# Altium project LabGener.PrjPcb
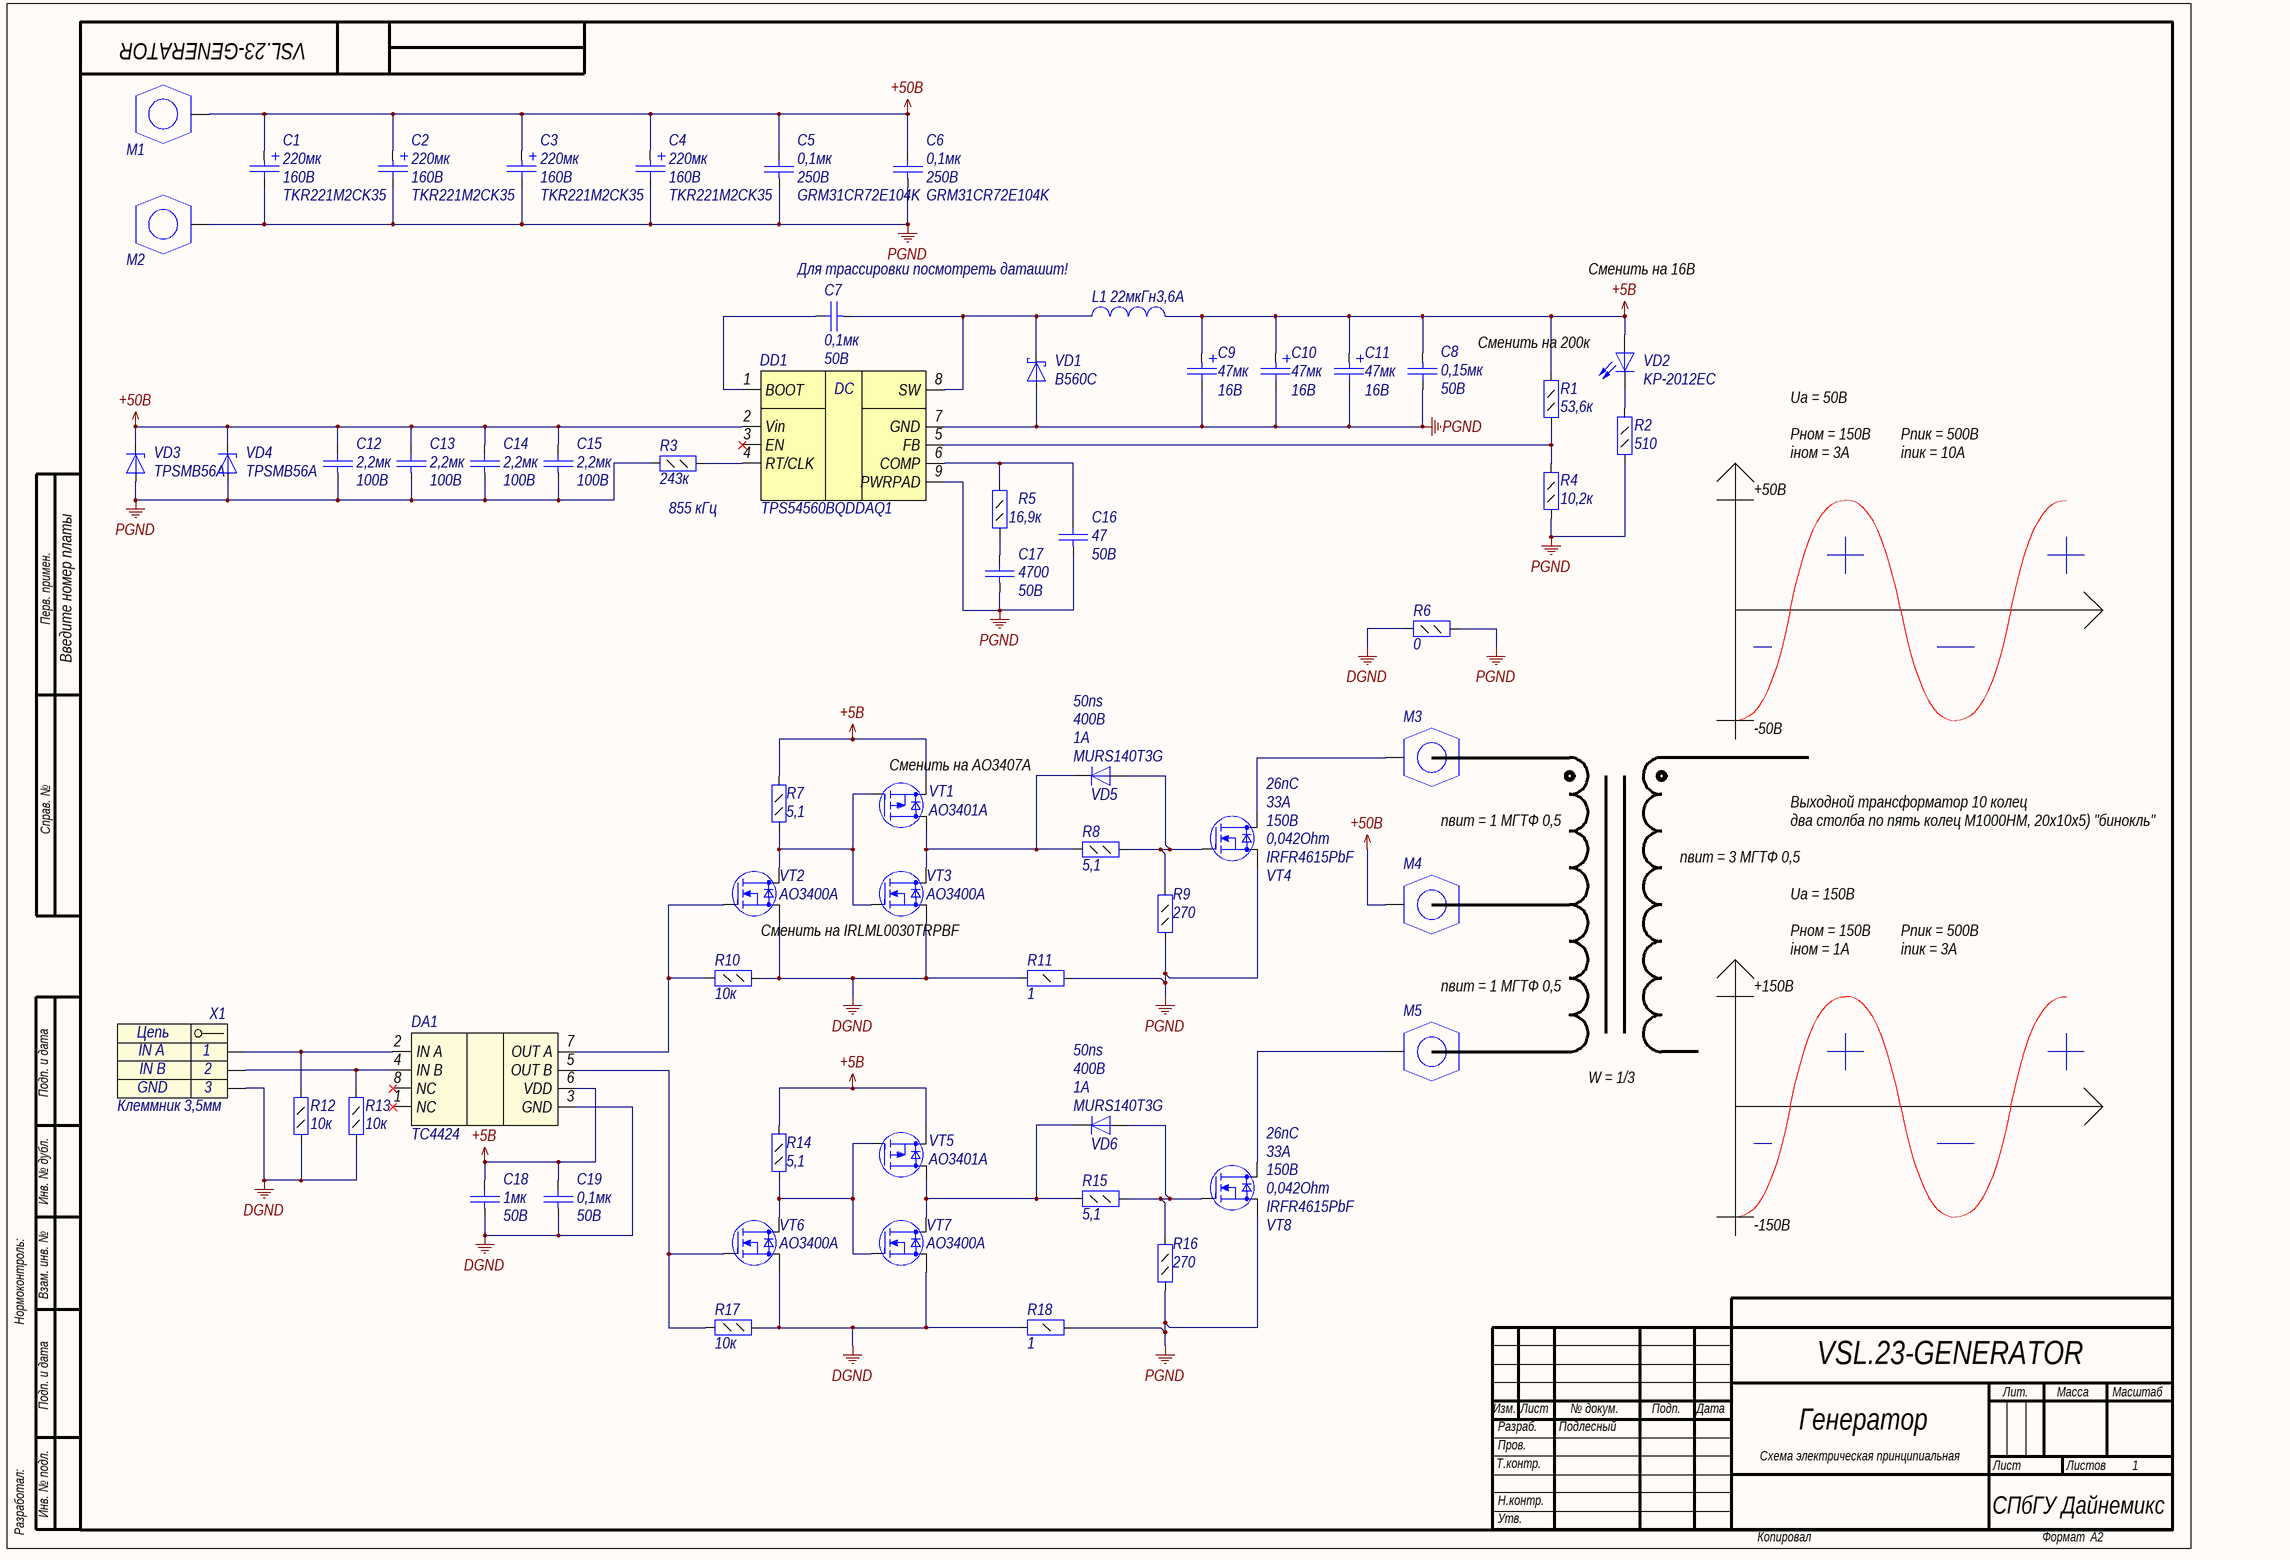
[diagram p0: LabGener.SchDoc]
1 sheet, 60 parts. Net scope: global (net labels, ports and power ports of the same name join across sheets).
Board file: LabGener.PcbDoc

## Sheet LabGener.SchDoc: Название платы
size 594 x 420 mm; ApprovedBy: Рогов; CheckedBy: Фамилия проверяющего; DrawnBy: Подлесный; Organization: СПбГУ Дайнемикс; DocumentNumber: VSL.23-GENERATOR; SheetNumber: пусто если листов 1, иначе 1; SheetTotal: количество листов; Format: A2; DocumentType: Схема электрическая принципиальная; Title1str: (вторая строка при необходимости); ImagePath: Введите номер платы

### Parts
C1  value 220мк  Voltage: 160B  Part Number: TKR221M2CK35  [K50-35(16X35)_V]  (hidden comment: Capacitor_pol)
C2  value 220мк  Voltage: 160B  Part Number: TKR221M2CK35  [K50-35(16X35)_V]  (hidden comment: Capacitor_pol)
C3  value 220мк  Voltage: 160B  Part Number: TKR221M2CK35  [K50-35(16X35)_V]  (hidden comment: Capacitor_pol)
C4  value 220мк  Voltage: 160B  Part Number: TKR221M2CK35  [K50-35(16X35)_V]  (hidden comment: Capacitor_pol)
C5  Voltage: 250В  Part Number: GRM31CR72E104K  [C1206]  (hidden comment: 0,1мк)
C6  Voltage: 250В  Part Number: GRM31CR72E104K  [C1206]  (hidden comment: 0,1мк)
C7  Voltage: 50В  [C0402]  (hidden comment: 0,1мк)
C8  Voltage: 50В  [C1812]  (hidden comment: 0,15мк)
C9  value 47мк  Voltage: 16В  [TANTAL CASE C]  (hidden comment: Capacitor_pol)
C10  value 47мк  Voltage: 16В  [TANTAL CASE C]  (hidden comment: Capacitor_pol)
C11  value 47мк  Voltage: 16В  [TANTAL CASE C]  (hidden comment: Capacitor_pol)
C12  Voltage: 100В  [C1812]  (hidden comment: 2,2мк)
C13  Voltage: 100В  [C1812]  (hidden comment: 2,2мк)
C14  Voltage: 100В  [C1812]  (hidden comment: 2,2мк)
C15  Voltage: 100В  [C1812]  (hidden comment: 2,2мк)
C16  Voltage: 50В  [C0805]  (hidden comment: 47)
C17  Voltage: 50В  [C0805]  (hidden comment: 4700)
C18  Voltage: 50B  [C0805]  (hidden comment: 1мк)
C19  Voltage: 50В  [C0805]  (hidden comment: 0,1мк)
DA1  TC4424  [DIP8]
DD1  Part Number: TPS54560BQDDAQ1  [SO Powerpad8]  (hidden comment: TPS54560)
L1  value 22мкГн  Rated Current: 3,6A  [IND_12.5x12.5]  (hidden comment: Inductor)
M1  SCREW  [SCREW2.5]  (value not drawn)
M2  SCREW  [SCREW2.5]  (value not drawn)
M3  SCREW  [SCREW2.5]  (value not drawn)
M4  SCREW  [SCREW2.5]  (value not drawn)
M5  SCREW  [SCREW2.5]  (value not drawn)
R1  value 53,6к  [R0805]  (hidden comment: Resistor_0,125Вт)
R2  value 510  [R0805]  (hidden comment: Resistor_0,125Вт)
R3  value 243к  [R0805]  (hidden comment: Resistor_0,125Вт)
R4  value 10,2к  [R0805]  (hidden comment: Resistor_0,125Вт)
R5  value 16,9к  [R0805]  (hidden comment: Resistor_0,125Вт)
R6  value 0  [R0805]  (hidden comment: Resistor_0,125Вт)
R7  value 5,1  [R0805]  (hidden comment: Resistor_0,125Вт)
R8  value 5,1  [R0805]  (hidden comment: Resistor_0,125Вт)
R9  value 270  [R0805]  (hidden comment: Resistor_0,125Вт)
R10  value 10к  [R0805]  (hidden comment: Resistor_0,125Вт)
R11  value 1  [R1206]  (hidden comment: Resistor_0,25Вт)
R12  value 10к  [R0805]  (hidden comment: Resistor_0,125Вт)
R13  value 10к  [R0805]  (hidden comment: Resistor_0,125Вт)
R14  value 5,1  [R0805]  (hidden comment: Resistor_0,125Вт)
R15  value 5,1  [R0805]  (hidden comment: Resistor_0,125Вт)
R16  value 270  [R0805]  (hidden comment: Resistor_0,125Вт)
R17  value 10к  [R0805]  (hidden comment: Resistor_0,125Вт)
R18  value 1  [R1206]  (hidden comment: Resistor_0,25Вт)
VD1  Part Number: B560C  [SMC]  (hidden comment: DiodeSchottky)
VD2  Part Number: KP-2012EC  [L_0805]  (hidden comment: LED)
VD3  Part Number: TPSMB56A  [SMB]  (hidden comment: DiodeZener)
VD4  Part Number: TPSMB56A  [SMB]  (hidden comment: DiodeZener)
VD5  Forward Current: 1A  Breakdown Voltage: 400B  Reverse Recovery time: 50ns  Part Number: MURS140T3G  [SMB]  (hidden comment: Diode)
VD6  Forward Current: 1A  Breakdown Voltage: 400B  Reverse Recovery time: 50ns  Part Number: MURS140T3G  [SMB]  (hidden comment: Diode)
VT1  Part Number: AO3401A  [SOT23-3]  (hidden comment: P-MOSFET)
VT2  Part Number: AO3400A  [SOT23-3]  (hidden comment: N-MOSFET)
VT3  Part Number: AO3400A  [SOT23-3]  (hidden comment: N-MOSFET)
VT4  V drain-source max: 150B  Rds: 0,042Ohm  Continuous drain current: 33A  Total gate charge: 26nC  Part Number: IRFR4615PbF  [DPAK]  (hidden comment: N-MOSFET)
VT5  Part Number: AO3401A  [SOT23-3]  (hidden comment: P-MOSFET)
VT6  Part Number: AO3400A  [SOT23-3]  (hidden comment: N-MOSFET)
VT7  Part Number: AO3400A  [SOT23-3]  (hidden comment: N-MOSFET)
VT8  V drain-source max: 150B  Rds: 0,042Ohm  Continuous drain current: 33A  Total gate charge: 26nC  Part Number: IRFR4615PbF  [DPAK]  (hidden comment: N-MOSFET)
X1  Клеммник 3,5мм  [TERMINAL-3WAY-3.5MM]

### Nets
+5B: C8.1 C9.1 C10.1 C11.1 C18.2 C19.2 DA1.6(VDD) L1.2 R1.2 R7.2 R14.2 VD2.2(A) VT1.3(S) VT5.3(S)
+50B: C1.1 C2.1 C3.1 C4.1 C5.2 C6.2 C12.2 C13.2 C14.2 C15.2 DD1.2(Vin) M1.1 M4.1 VD3.1(K) VD4.1(K)
DGND: C18.1 C19.1 DA1.3(GND) R6.1 R10.1 R11.1 R12.1 R13.1 R17.1 R18.1 VT2.3(S) VT3.3(S) VT6.3(S) VT7.3(S) X1.3
PGND: C1.2 C2.2 C3.2 C4.2 C5.1 C6.1 C8.2 C9.2 C10.2 C11.2 C12.1 C13.1 C14.1 C15.1 C16.1 C17.1 DD1.7(GND) DD1.9(PWRPAD) M2.1 R2.1 R3.1 R4.1 R6.2 R9.1 R11.2 R16.1 R18.2 VD1.2(A) VD3.2(A) VD4.2(A) VT4.3(S) VT8.3(S)
NetC7_1: C7.1 DD1.8(SW) L1.1 VD1.1(K)
NetC7_2: C7.2 DD1.1(BOOT)
NetC16_2: C16.2 DD1.6(COMP) R5.2
NetC17_2: C17.2 R5.1
NetDA1_2: DA1.2(IN_A) R12.2 X1.1
NetDA1_4: DA1.4(IN_B) R13.2 X1.2
NetDA1_5: DA1.5(OUT_B) R17.2 VT6.1(G)
NetDA1_7: DA1.7(OUT_A) R10.2 VT2.1(G)
NetDD1_4: DD1.4(RT/CLK) R3.2
NetDD1_5: DD1.5(FB) R1.1 R4.2
NetM3_1: M3.1 VT4.2(D)
NetM5_1: M5.1 VT8.2(D)
NetR2_2: R2.2 VD2.1(K)
NetR7_1: R7.1 VT1.1(G) VT2.2(D) VT3.1(G)
NetR8_1: R8.1 VD5.1(K) VT1.2(D) VT3.2(D)
NetR8_2: R8.2 R9.2 VD5.2(A) VT4.1(G)
NetR14_1: R14.1 VT5.1(G) VT6.2(D) VT7.1(G)
NetR15_1: R15.1 VD6.1(K) VT5.2(D) VT7.2(D)
NetR15_2: R15.2 R16.2 VD6.2(A) VT8.1(G)

Not connected (* = marked no-connect by the designer): DA1 1(NC)* 8(NC)*; DD1 3(EN)*

### Notes on the sheet
- Для трассировки посмотреть даташит!
- Cменить на 16В
- Cменить на 200к
- Ua = 50B
- Pном = 150B
- Pпик = 500B
- iном = 3A
- iпик = 10A
- 855 кГц
- +50B
- Перв. примен.
- (near VT1) Cменить на AO3407A
- -50B
- Справ. №
- Выходной трансформатор 10 колец
- nвит = 1 МГТФ 0,5
- nвит = 3 МГТФ 0,5
- два столба по пять колец М1000НМ, 20х10х5) "бинокль"
- Ua = 150B
- Cменить на IRLML0030TRPBF
- iном = 1A
- iпик = 3A
- +150B
- Подп. и дата
- W = 1/3
- Инв. № дубл.
- -150B
- Нормоконтроль:
- Взам. инв. №
- Изм.
- Лист
- № докум.
- Подп.
- Дата
- Лит.
- Масса
- Масштаб
- Т.контр.
- Пров.
- Разраб.
- Подлесный
- Схема электрическая принципиальная
- Генератор
- Листов
- 1
- Разработал:
- Инв. № подл.
- Н.контр.
- Утв.
- Копировал
- Формат
- (in symbol connect35) Цепь
- (in symbol pwr127) DC

### Library data of the parts
C1-C4 = cap278: Конденсатор полярный; Part Name: Electrolit; Manufacture: Jamicon; id: cap278; ESR: 95мОм; Zmax: 38мОм; Iac max: 0,5А; Iac rated: 0,9А
C5 C6 = cap179: Конденсатор; Part Name: Ceramic; Manufacture: Murata; id: cap179; TKE: X7R; Value: 0,1мк
C7 = cap277: Конденсатор; Part Name: Ceramic; Manufacture: Murata; Part Number: GRM155R71H104KE14D; id: cap277; TKE: X7R; tga: 0,10%; Value: 0,1мк
C8 = cap285: Конденсатор; Part Name: Ceramic; Manufacture: TDK; Part Number: C4532C0G1H154J250KA; id: cap285; TKE: NP0; Value: 0,15мк
C9-C11 = cap306: Конденсатор полярный; Part Name: Tantal; Manufacture: Китай; Part Number: TECAP47/16VC10; id: cap306
C12-C15 = cap293: Конденсатор; Part Name: MLCC; Manufacture: TDK; Part Number: C4532X7R2A225M; id: cap293; TKE: X7R; tga: 0,10%; Value: 2,2мк
C16 = cap305: Конденсатор; Part Name: MLCC; Manufacture: Murata; Part Number: GRM2165C1H470JD01D; id: cap305; TKE: NP0; tga: 0,10%; Value: 47
C17 = cap169: Конденсатор; Part Name: Ceramic; Manufacture: Murata; Part Number: GRM216R71H472K; id: cap169; TKE: X7R; Value: 4700
C18 = cap151: Конденсатор; Part Name: Ceramic; Manufacture: Murata; Part Number: GRM21BR71H105K; id: cap151; TKE: X7R; Value: 1мк
C19 = cap160: Конденсатор; Part Name: Ceramic; Manufacture: Murata; Part Number: GRM21BR71H104KA01L; id: cap160; TKE: X7R; Value: 0,1мк
DA1 = driver29: 3A Dual High-Speed Power MOSFET Drivers; Manufacture: Microchip; Part Number: TC4424CPA; Logic High: 2,4В; Logic Low: 0,8B-1,6B; Min Operating Supply Voltage: 4,5B; Max Operating Supply Voltage: 18B; “A” OUTPUT: Noninverting; Max Supply Current: 2,5mA; Maximum Power Dissipation: 730mW; id: driver29; Part Name: 3A Dual High-Speed Power MOSFET Drivers; “B” OUTPUT: Noninverting; Maximum output current: 3A
DD1 = pwr127: 5-A, Wide Input Range, Step-Down Converter; Part Name: Step Down DC-DC Converter with Eco-mode; Manufacturer: Texas Instruments; id: pwr127; Input Voltage: 4,5-60В; Output Voltage: 0,8B-58,8B; Current: 5A; Frequency: 100 kHz-25 MHz; Type: Impulse
L1 = ind79: EMI Suppression Filter; Part Name: SMD Power Inductors; Part Number: B82477G4223M000; Manufacture: Epcos; id: ind79; Saturation Current: 4,25A; Resistance: 0,038Ohm
M1-M5 = connect88: Part Name: Винт М2.5 с заземлением; id: connect88
R1 = res1234: Резистор; Manufacture: Yageo; Part Number: RC0805FR-0753K6L; Accuracy: 0,01; id: res1234; Part Name: Resistor; Power: 0,125Вт
R2 = res68: Резистор; Manufacture: Yageo; Part Number: RC0805FR-07510RL; id: res68; Accuracy: 0,01; Part Name: Resistor; Power: 0,125Вт
R3 = res1189: Резистор; Manufacture: Yageo; Part Number: RC0805FR-07243KL; Accuracy: 0,01; id: res1189; Part Name: Resistor; Power: 0,125Вт
R4 = res1230: Резистор; Manufacture: Yageo; Part Number: RC0805FR-0710K2L; Accuracy: 0,01; id: res1230; Part Name: Resistor; Power: 0,125Вт
R5 = res1186: Резистор; Manufacture: Yageo; Part Number: RC0805FR-0716K9L; Accuracy: 0,01; id: res1186; Part Name: Resistor; Power: 0,125Вт
R6 = res0: Резистор; Manufacture: Yageo; Part Number: RC0805FR-070RL; id: res0; Accuracy: 0,01; Part Name: Resistor; Power: 0,125Вт
R7 R8 R14 R15 = res18: Резистор; Manufacture: Yageo; Part Number: RC0805FR-075R1L; id: res18; Accuracy: 0,01; Part Name: Resistor; Power: 0,125Вт
R9 R16 = res60: Резистор; Manufacture: Yageo; Part Number: RC0805FR-07270RL; id: res60; Accuracy: 0,01; Part Name: Resistor; Power: 0,125Вт
R10 R12 R13 R17 = res101: Резистор; Manufacture: Yageo; Part Number: RC0805FR-0710KL; id: res101; Accuracy: 0,01; Part Name: Resistor; Power: 0,125Вт
R11 R18 = res584: Резистор; Manufacture: Yageo; Part Number: RC1206FR-071RL; id: res584; Accuracy: 0,01; Power: 0,25Вт; Part Name: Resistor
VD1 = diode32: Диод Шоттки; Part Name: SCHOTTKY BARRIER RECTIFIER; Manufacture: Diodes Incorporated; Max Reverse Voltage: 60B; Forward Voltage: 0,7B; Forward Current: 5A; Leakage current: 20mA; Capacitance: 300pF; Number of Channels: 1; id: diode32; Breakdown Voltage: 60B; Temp MAX: +150; Temp MIN: -55
VD2 = diode5: Светодиод; id: diode5; Part Name: LED
VD3 VD4 = TPSMB56A: Cтабилитрон (лавинный выпрямительный диод) односторонний; Part Name: TVS diode Unidirectional; Manufacture: Littelfuse; id: tvs285; Leakage Current: 8uA; Stand-off Voltage: 56B; Breakdown Voltage: 58,8B; Clamping voltage: 77B; Peak Pulse Power: 600W; Number of diodes: 1
VD5 VD6 = diode33: Диод; Part Name: Ultrafast Power Rectifiers; Manufacture: ON Semiconductor; Forward Voltage: 1,25B; id: diode33; Max Reverse Voltage: 400B
VT1 VT5 = mosfert27: N-MOSFET; Manufacturer: Alpha&Omega; Structure: p-channel; V drain-source max: (-30B); Rds: 0,06Ohm; Gate-to-source voltage: (+-)12B; Continuous drain current: (-4)A; Total gate charge: 14nC; Pulsed drain current: (-27)A; Power dissipation: 1,4W; id: mosfert27
VT2 VT3 VT6 VT7 = mosfert26: Manufacturer: Alpha&Omega; Structure: n-channel; V drain-source max: 30B; Rds: 0,032Ohm; Gate-to-source voltage: (+-)12B; Continuous drain current: 5,7A; Total gate charge: 7nC; Pulsed drain current: 30A; Power dissipation: 1,4W; id: mosfert26
VT4 VT8 = mosfert20: Manufacturer: International Rectifier; Structure: n-channel; Gate-to-source voltage: (+-)20B; Pulsed drain current: 140A; Power dissipation: 144W; id: mosfert20
X1 = connect35: Разъем - 3 конт. клеммник; Part Name: TERMINAL BLOCK 3 way; Contact_1: IN A; Contact_2: IN B; Contact_3: GND; Etch: 3.5mm; id: connect35